# EAGLE schematic Arduino_Nano_33_IOT_Header_Schematic (EAGLE 9.7.0)
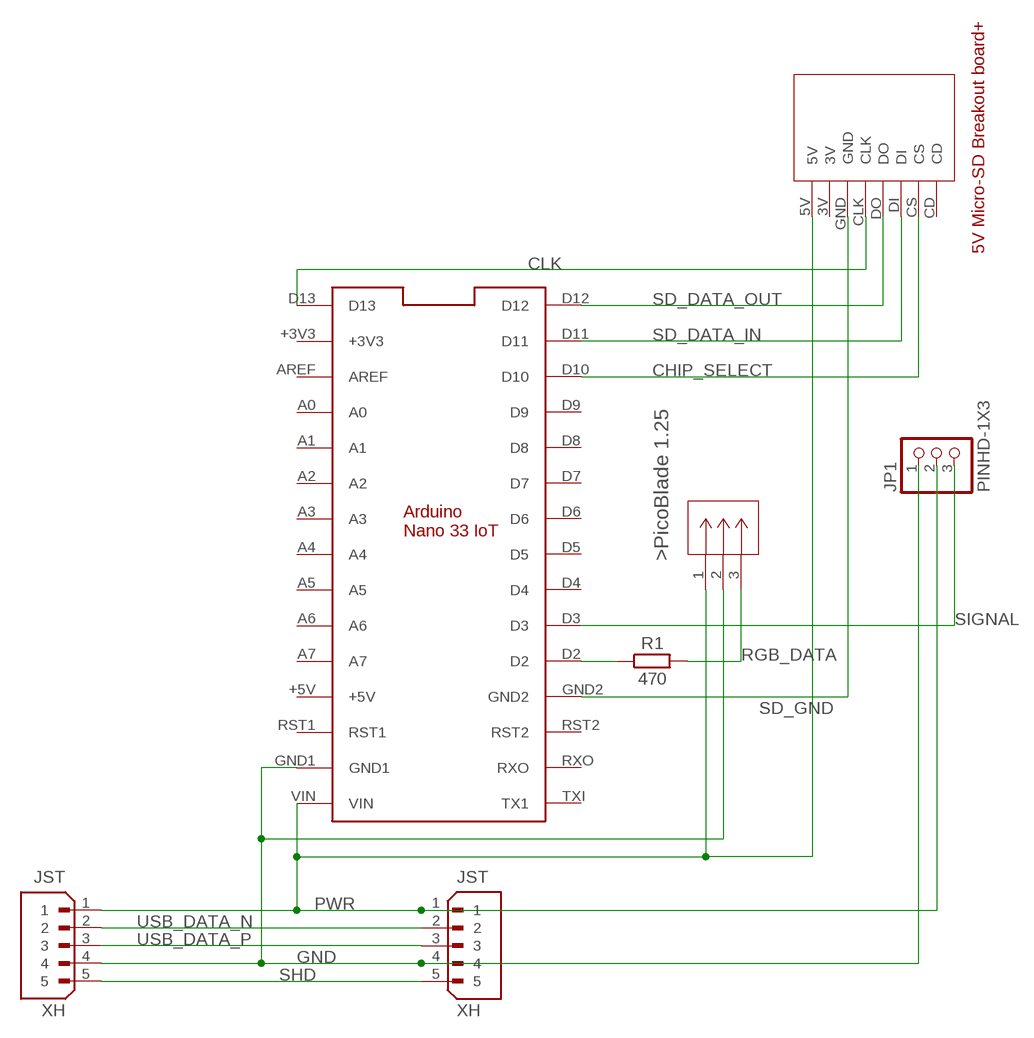
[diagram p0: schematic, sheet 1]

## Parts
HEADER2PCB  B5B-XH-A  [JST_B5B-XH-A]
J1  PICOBLADE_1.25_3-PINCONN03_530470310_MOL  [PICOBLADE_1.25_3-PIN]
JP1  PINHD-1X3  [1X03]
MICROSD_HEADER  MICROSDCARDBREAKOUTBOARD+HEADER  [5V_MICRO-SD_BREAKOUT+_HEADERS]
R1  470  RESISTOR__AXIAL-7.2MM-PITCH  [RESAD724W46L381D178B]
U$2  ARDUINO_NANOHEADERS  [NANO_33_IOT_HEADER]
USBCONNECT  B5B-XH-A  [JST_B5B-XH-A]

## Nets
CHIP_SELECT: MICROSD_HEADER.CS U$2.D10
CLK: MICROSD_HEADER.CLK U$2.D13
GND: HEADER2PCB.4 J1.2 JP1.1 U$2.GND1 USBCONNECT.4
N$1: R1.1 U$2.D2
PWR: HEADER2PCB.1 J1.1 JP1.2 MICROSD_HEADER.5V U$2.VIN USBCONNECT.1
RGB_DATA: J1.3 R1.2
SD_DATA_IN: MICROSD_HEADER.DI U$2.D11
SD_DATA_OUT: MICROSD_HEADER.DO U$2.D12
SD_GND: MICROSD_HEADER.GND U$2.GND2
SHD: HEADER2PCB.5 USBCONNECT.5
SIGNAL: JP1.3 U$2.D3
USB_DATA_N: HEADER2PCB.2 USBCONNECT.2
USB_DATA_P: HEADER2PCB.3 USBCONNECT.3
Unconnected: MICROSD_HEADER.3V MICROSD_HEADER.CD U$2.+3V3 U$2.+5V U$2.A0 U$2.A1 U$2.A2 U$2.A3 U$2.A4 U$2.A5 U$2.A6 U$2.A7 U$2.AREF U$2.D4 U$2.D5 U$2.D6 U$2.D7 U$2.D8 U$2.D9 U$2.RST1 U$2.RST2 U$2.RXO U$2.TXI(TX1)

## Library data of the parts
HEADER2PCB USBCONNECT = Custom Library:B5B-XH-A; MANUFACTURER: JST; MAXIMUM_PACKAGE_HEIGHT: 7.00 mm; MPN: 3; PARTREV: 7/4/21; STANDARD: Manufacturer Recommendations
J1 = Custom Library:PICOBLADE_1.25_3-PIN; COPYRIGHT: Copyright (C) 2025 Ultra Librarian. All rights reserved.; DATASHEET: https://www.molex.com/en-us/products/part-detail-pdf/530470310?display=pdf; DESCRIPTION: 1.25mm Pitch, PicoBlade PCB Header, Single Row, Vertical, Through Hole, Tin Plating, Friction Lock, 3 Circuits, Tray, 2.30mm PC Tail Length; MANUFACTURER: Molex; MANUFACTURER_NAME: Molex Connector Corporation; MANUFACTURER_PART_NUMBER: 530470310; MPN: 530470310
JP1 = Connector:PINHD-1X3: PIN HEADER; CATEGORY: Headers; DESCRIPTION: Header-Straight-3 Position; PACKAGE_TYPE: THT; PITCH: 0.100" (2.54mm); SUBCATEGORY: Headers-Male Pins; TYPE: Board to Board or Cable-Unshrouded-Through Hole-Straight
MICROSD_HEADER = Pre-Built Boards:MICROSDCARDBREAKOUTBOARD+
R1 = Tinkercad:RESISTOR: Resistor Fixed - Generic; CATEGORY: Resistor; SUB-CATEGORY: Fixed
U$2 = Pre-Built Boards:ARDUINO_NANO